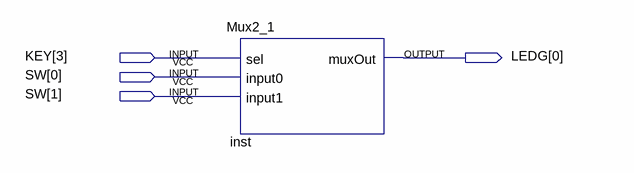
[diagram p0: schematic sheet]
// Quartus schematic MUx2_1Demo.bdf as structural Verilog: 1 symbols, 4 pins
module MUx2_1Demo (
  input  [3:3] KEY,
  input  [1:0] SW,
  output [0:0] LEDG
);

  Mux2_1 inst (.sel(KEY[3]), .input0(SW[0]), .input1(SW[1]), .muxOut(LEDG[0]));
endmodule
